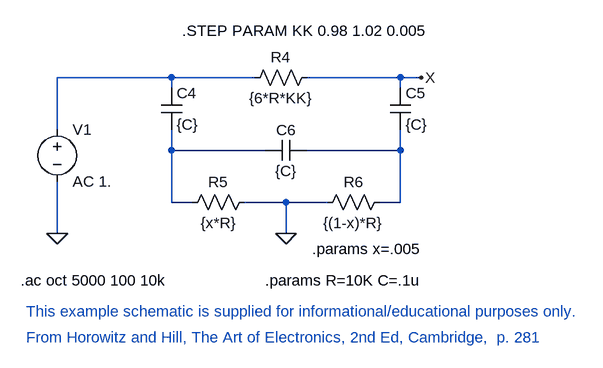
[diagram p0: schematic Fig_9-3_notch_KK.asc]
Fig_9-3_notch_KK.asc, the LTspice schematic file:
Version 4
SHEET 1 5945676 13421556
WIRE 2128 -432 1952 -432
WIRE 2256 -432 2128 -432
WIRE 2480 -432 2336 -432
WIRE 2512 -432 2480 -432
WIRE 2128 -416 2128 -432
WIRE 2480 -416 2480 -432
WIRE 1952 -352 1952 -432
WIRE 2128 -320 2128 -352
WIRE 2272 -320 2128 -320
WIRE 2480 -320 2480 -352
WIRE 2480 -320 2336 -320
WIRE 2128 -240 2128 -320
WIRE 2160 -240 2128 -240
WIRE 2304 -240 2240 -240
WIRE 2368 -240 2304 -240
WIRE 2480 -240 2480 -320
WIRE 2480 -240 2448 -240
WIRE 1952 -192 1952 -272
WIRE 2304 -192 2304 -240
FLAG 1952 -192 0
FLAG 2304 -192 0
FLAG 2512 -432 X
SYMBOL voltage 1952 -368 R0
SYMATTR InstName V1
SYMATTR Value AC 1.
SYMBOL res 2352 -448 R90
WINDOW 0 0 56 VBottom 2
WINDOW 3 32 56 VTop 2
SYMATTR InstName R4
SYMATTR Value {6*R*KK}
SYMBOL cap 2112 -416 R0
SYMATTR InstName C4
SYMATTR Value {C}
SYMBOL cap 2464 -416 R0
SYMATTR InstName C5
SYMATTR Value {C}
SYMBOL cap 2336 -336 R90
WINDOW 0 0 32 VBottom 2
WINDOW 3 32 32 VTop 2
SYMATTR InstName C6
SYMATTR Value {C}
SYMBOL res 2256 -256 R90
WINDOW 0 0 56 VBottom 2
WINDOW 3 32 56 VTop 2
SYMATTR InstName R5
SYMATTR Value {x*R}
SYMBOL res 2464 -256 R90
WINDOW 0 0 56 VBottom 2
WINDOW 3 32 56 VTop 2
SYMATTR InstName R6
SYMATTR Value {(1-x)*R}
TEXT 1896 -120 Left 2 !.ac oct 5000 100 10k
TEXT 2272 -120 Left 2 !.params R=10K C=.1u
TEXT 1904 -32 Left 2 ;From Horowitz and Hill, The Art of Electronics, 2nd Ed, Cambridge,  p. 281
TEXT 2344 -168 Left 2 !.params x=.005
TEXT 1904 -72 Left 2 ;This example schematic is supplied for informational/educational purposes only.
TEXT 2144 -504 Left 2 !.STEP PARAM KK 0.98 1.02 0.005

The netlist it stands for:
* Fig_9-3_notch_KK.asc
V1 N001 0 AC 1.
R4 X N001 {6*R*KK}
C4 N001 N002 {C}
C5 X N003 {C}
C6 N003 N002 {C}
R5 0 N002 {x*R}
R6 N003 0 {(1-x)*R}
.ac oct 5000 100 10k
.params R=10K C=.1u
* From Horowitz and Hill, The Art of Electronics, 2nd Ed, Cambridge,  p. 281
.params x=.005
* This example schematic is supplied for informational/educational purposes only.
.STEP PARAM KK 0.98 1.02 0.005
.backanno
.end